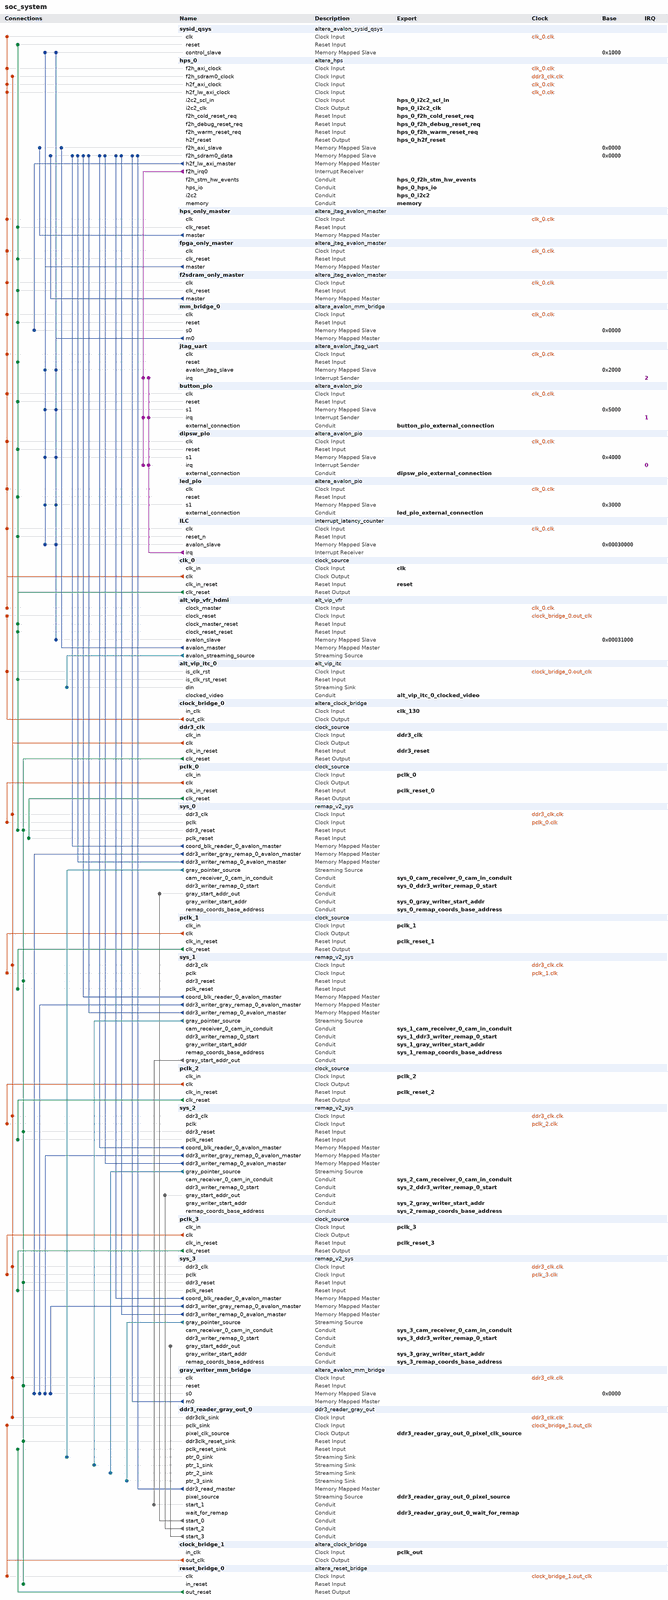
[diagram p0: system contents, whole]
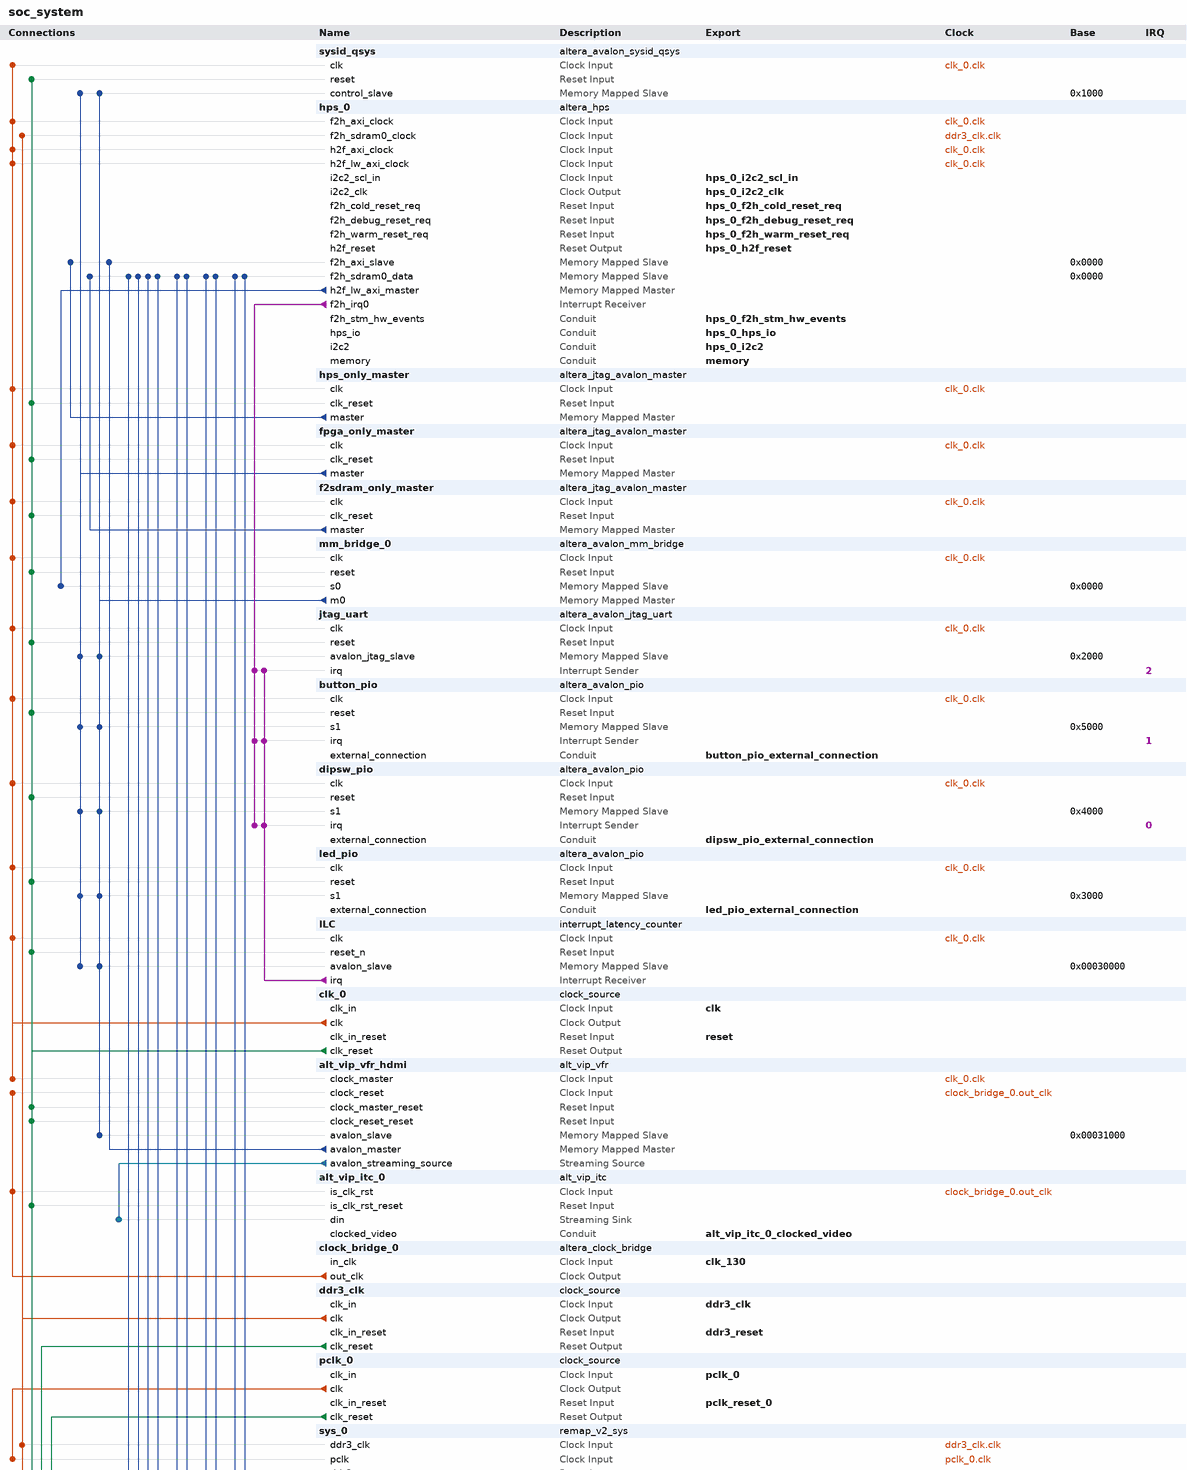
[diagram p1: system contents, upper part]
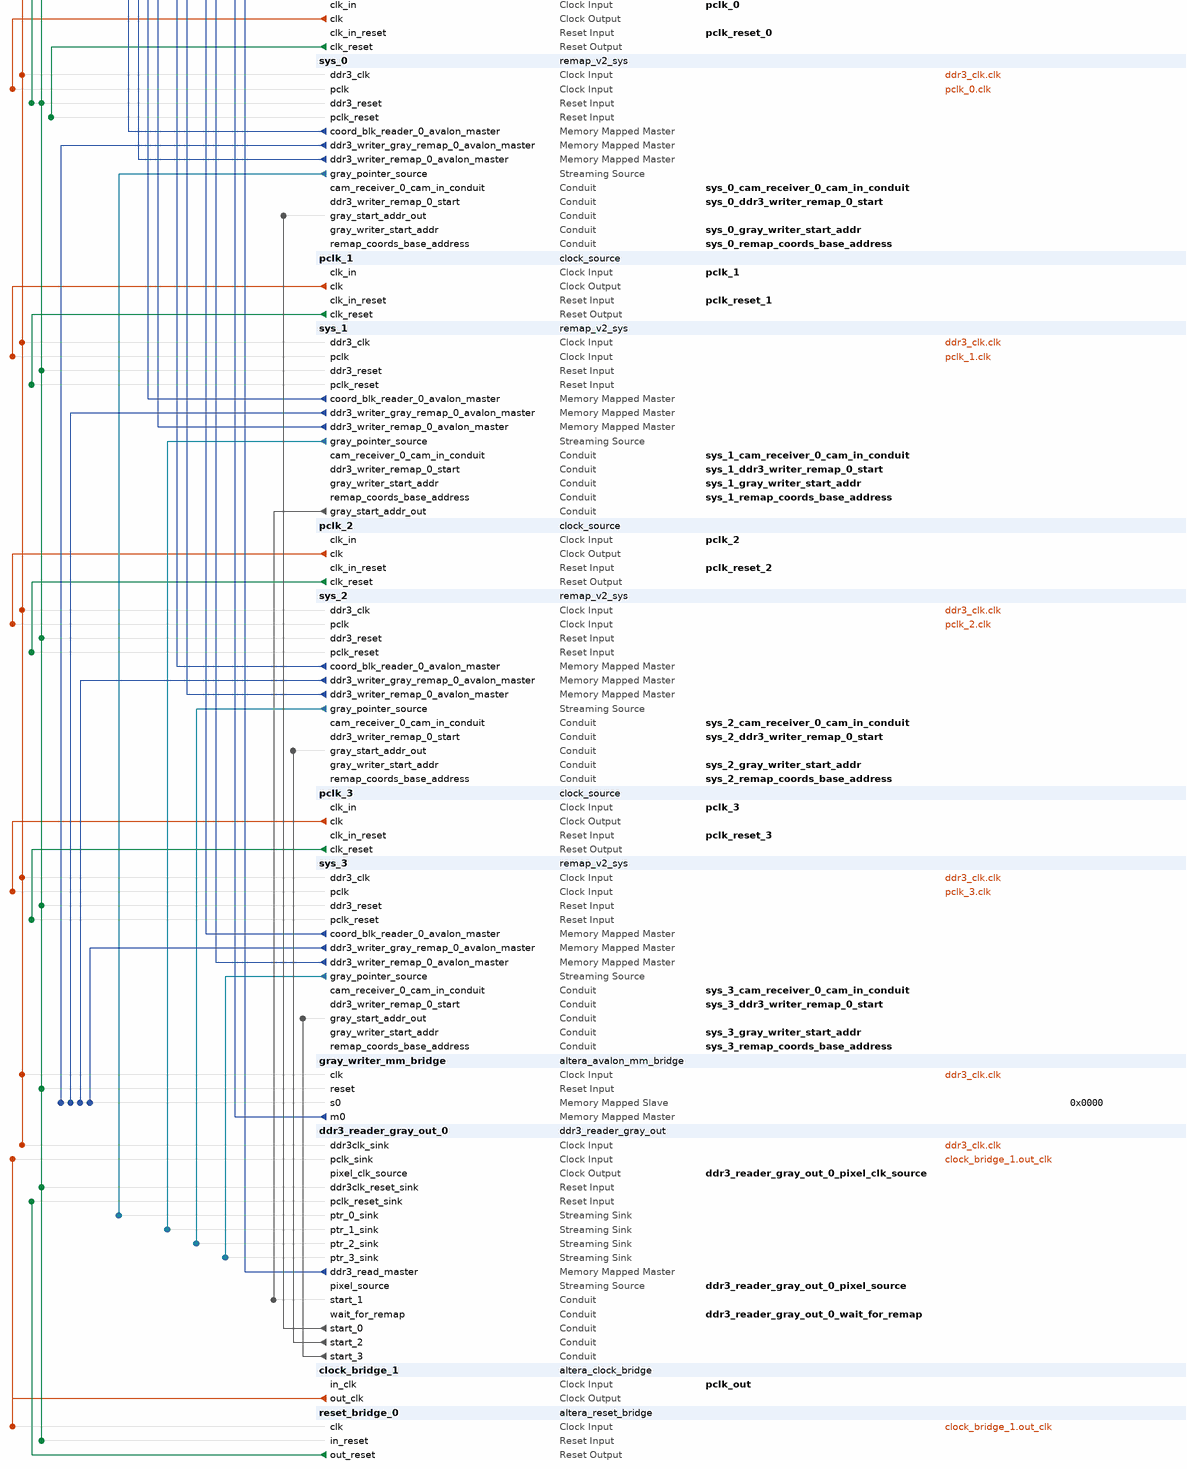
[diagram p2: system contents, lower part]
# Platform Designer (Qsys) system soc_system, Cyclone V 5CSEBA6U23I7
# Parameters at their usual value, and those the tool derives, are not listed.
package require -exact qsys 18.1
create_system soc_system
set_project_property DEVICE_FAMILY {Cyclone V}
set_project_property DEVICE 5CSEBA6U23I7

add_instance sysid_qsys altera_avalon_sysid_qsys 18.1
set_instance_parameter_value sysid_qsys id -1395322110

add_instance hps_0 altera_hps 18.1
set_instance_parameter_value hps_0 EMAC1_Mode RGMII
set_instance_parameter_value hps_0 EMAC1_PinMuxing {HPS I/O Set 0}
set_instance_parameter_value hps_0 F2SCLK_COLDRST_Enable true
set_instance_parameter_value hps_0 F2SCLK_DBGRST_Enable true
set_instance_parameter_value hps_0 F2SCLK_WARMRST_Enable true
set_instance_parameter_value hps_0 F2SDRAM_Type {Avalon-MM Bidirectional}
set_instance_parameter_value hps_0 F2SDRAM_Width 256
set_instance_parameter_value hps_0 F2SINTERRUPT_Enable true
set_instance_parameter_value hps_0 F2S_Width 3
set_instance_parameter_value hps_0 FPGA_PERIPHERAL_OUTPUT_CLOCK_FREQ_EMAC0_GTX_CLK 100
set_instance_parameter_value hps_0 FPGA_PERIPHERAL_OUTPUT_CLOCK_FREQ_EMAC0_MD_CLK 100.0
set_instance_parameter_value hps_0 FPGA_PERIPHERAL_OUTPUT_CLOCK_FREQ_EMAC1_GTX_CLK 100
set_instance_parameter_value hps_0 FPGA_PERIPHERAL_OUTPUT_CLOCK_FREQ_EMAC1_MD_CLK 100.0
set_instance_parameter_value hps_0 HPS_PROTOCOL DDR3
set_instance_parameter_value hps_0 I2C0_Mode I2C
set_instance_parameter_value hps_0 I2C0_PinMuxing {HPS I/O Set 0}
set_instance_parameter_value hps_0 I2C1_Mode I2C
set_instance_parameter_value hps_0 I2C1_PinMuxing {HPS I/O Set 0}
set_instance_parameter_value hps_0 I2C2_Mode Full
set_instance_parameter_value hps_0 I2C2_PinMuxing FPGA
set_instance_parameter_value hps_0 LWH2F_Enable true
set_instance_parameter_value hps_0 MEM_BANKADDR_WIDTH 3
set_instance_parameter_value hps_0 MEM_CLK_FREQ 400.0
set_instance_parameter_value hps_0 MEM_COL_ADDR_WIDTH 10
set_instance_parameter_value hps_0 MEM_DQ_WIDTH 32
set_instance_parameter_value hps_0 MEM_DRV_STR RZQ/6
set_instance_parameter_value hps_0 MEM_ROW_ADDR_WIDTH 15
set_instance_parameter_value hps_0 MEM_RTT_NOM RZQ/6
set_instance_parameter_value hps_0 MEM_RTT_WR {Dynamic ODT off}
set_instance_parameter_value hps_0 MEM_TCL 7
set_instance_parameter_value hps_0 MEM_TFAW_NS 37.5
set_instance_parameter_value hps_0 MEM_TRAS_NS 35.0
set_instance_parameter_value hps_0 MEM_TRCD_NS 13.75
set_instance_parameter_value hps_0 MEM_TRFC_NS 300.0
set_instance_parameter_value hps_0 MEM_TRP_NS 13.75
set_instance_parameter_value hps_0 MEM_VENDOR Other
set_instance_parameter_value hps_0 MEM_WTCL 7
set_instance_parameter_value hps_0 QSPI_Mode N/A
set_instance_parameter_value hps_0 QSPI_PinMuxing Unused
set_instance_parameter_value hps_0 REF_CLK_FREQ 25.0
set_instance_parameter_value hps_0 S2FCLK_USER2CLK 4
set_instance_parameter_value hps_0 S2F_Width 2
set_instance_parameter_value hps_0 SDIO_Mode {4-bit Data}
set_instance_parameter_value hps_0 SDIO_PinMuxing {HPS I/O Set 0}
set_instance_parameter_value hps_0 SPIM1_Mode {Single Slave Select}
set_instance_parameter_value hps_0 SPIM1_PinMuxing {HPS I/O Set 0}
set_instance_parameter_value hps_0 STM_Enable true
set_instance_parameter_value hps_0 TIMING_BOARD_AC_SKEW 0.02
set_instance_parameter_value hps_0 TIMING_BOARD_AC_TO_CK_SKEW 0.0
set_instance_parameter_value hps_0 TIMING_BOARD_DQ_TO_DQS_SKEW 0.0
set_instance_parameter_value hps_0 TIMING_BOARD_MAX_CK_DELAY 0.6
set_instance_parameter_value hps_0 TIMING_BOARD_MAX_DQS_DELAY 0.6
set_instance_parameter_value hps_0 TIMING_BOARD_SKEW_BETWEEN_DQS 0.02
set_instance_parameter_value hps_0 TIMING_BOARD_SKEW_CKDQS_DIMM_MAX 0.01
set_instance_parameter_value hps_0 TIMING_BOARD_SKEW_CKDQS_DIMM_MIN -0.01
set_instance_parameter_value hps_0 TIMING_BOARD_SKEW_WITHIN_DQS 0.02
set_instance_parameter_value hps_0 TIMING_TDH 125
set_instance_parameter_value hps_0 TIMING_TDQSCK 400
set_instance_parameter_value hps_0 TIMING_TDQSQ 120
set_instance_parameter_value hps_0 TIMING_TDS 50
set_instance_parameter_value hps_0 TIMING_TIH 250
set_instance_parameter_value hps_0 TIMING_TIS 175
set_instance_parameter_value hps_0 TIMING_TQSH 0.38
set_instance_parameter_value hps_0 UART0_Mode {No Flow Control}
set_instance_parameter_value hps_0 UART0_PinMuxing {HPS I/O Set 0}
set_instance_parameter_value hps_0 USB1_Mode SDR
set_instance_parameter_value hps_0 USB1_PinMuxing {HPS I/O Set 0}
set_instance_parameter_value hps_0 desired_cfg_clk_mhz 100.0
set_instance_parameter_value hps_0 desired_qspi_clk_mhz 370.0

add_instance hps_only_master altera_jtag_avalon_master 18.1

add_instance fpga_only_master altera_jtag_avalon_master 18.1

add_instance f2sdram_only_master altera_jtag_avalon_master 18.1

add_instance mm_bridge_0 altera_avalon_mm_bridge 18.1
set_instance_parameter_value mm_bridge_0 ADDRESS_UNITS SYMBOLS
set_instance_parameter_value mm_bridge_0 ADDRESS_WIDTH 10
set_instance_parameter_value mm_bridge_0 DATA_WIDTH 32
set_instance_parameter_value mm_bridge_0 MAX_PENDING_RESPONSES 4
set_instance_parameter_value mm_bridge_0 USE_AUTO_ADDRESS_WIDTH 1

add_instance jtag_uart altera_avalon_jtag_uart 18.1
set_instance_parameter_value jtag_uart allowMultipleConnections true
set_instance_parameter_value jtag_uart simInteractiveOptions INTERACTIVE_ASCII_OUTPUT

add_instance button_pio altera_avalon_pio 18.1
set_instance_parameter_value button_pio bitClearingEdgeCapReg true
set_instance_parameter_value button_pio captureEdge true
set_instance_parameter_value button_pio direction Input
set_instance_parameter_value button_pio edgeType FALLING
set_instance_parameter_value button_pio generateIRQ true
set_instance_parameter_value button_pio irqType EDGE
set_instance_parameter_value button_pio width 2

add_instance dipsw_pio altera_avalon_pio 18.1
set_instance_parameter_value dipsw_pio bitClearingEdgeCapReg true
set_instance_parameter_value dipsw_pio captureEdge true
set_instance_parameter_value dipsw_pio direction Input
set_instance_parameter_value dipsw_pio edgeType ANY
set_instance_parameter_value dipsw_pio generateIRQ true
set_instance_parameter_value dipsw_pio irqType EDGE
set_instance_parameter_value dipsw_pio width 4

add_instance led_pio altera_avalon_pio 18.1
set_instance_parameter_value led_pio direction Output
set_instance_parameter_value led_pio resetValue 255
set_instance_parameter_value led_pio width 8

add_instance ILC interrupt_latency_counter 18.1

add_instance clk_0 clock_source 18.1
set_instance_parameter_value clk_0 clockFrequency 50000000

add_instance alt_vip_vfr_hdmi alt_vip_vfr 14.0
set_instance_parameter_value alt_vip_vfr_hdmi MAX_IMAGE_WIDTH 1024

add_instance alt_vip_itc_0 alt_vip_itc 14.0
set_instance_parameter_value alt_vip_itc_0 FIFO_DEPTH 1920
set_instance_parameter_value alt_vip_itc_0 H_ACTIVE_PIXELS 1024
set_instance_parameter_value alt_vip_itc_0 H_BACK_PORCH 160
set_instance_parameter_value alt_vip_itc_0 H_FRONT_PORCH 24
set_instance_parameter_value alt_vip_itc_0 H_SYNC_LENGTH 136
set_instance_parameter_value alt_vip_itc_0 NUMBER_OF_COLOUR_PLANES 4
set_instance_parameter_value alt_vip_itc_0 THRESHOLD 1919
set_instance_parameter_value alt_vip_itc_0 V_ACTIVE_LINES 768
set_instance_parameter_value alt_vip_itc_0 V_BACK_PORCH 29
set_instance_parameter_value alt_vip_itc_0 V_FRONT_PORCH 3
set_instance_parameter_value alt_vip_itc_0 V_SYNC_LENGTH 6

add_instance clock_bridge_0 altera_clock_bridge 18.1
set_instance_parameter_value clock_bridge_0 DERIVED_CLOCK_RATE 0
set_instance_parameter_value clock_bridge_0 EXPLICIT_CLOCK_RATE 0

add_instance ddr3_clk clock_source 18.1
set_instance_parameter_value ddr3_clk clockFrequency 100000000

add_instance pclk_0 clock_source 18.1
set_instance_parameter_value pclk_0 clockFrequency 96000000

add_instance sys_0 remap_v2_sys 1.0

add_instance pclk_1 clock_source 18.1
set_instance_parameter_value pclk_1 clockFrequency 96000000

add_instance sys_1 remap_v2_sys 1.0

add_instance pclk_2 clock_source 18.1
set_instance_parameter_value pclk_2 clockFrequency 96000000

add_instance sys_2 remap_v2_sys 1.0

add_instance pclk_3 clock_source 18.1
set_instance_parameter_value pclk_3 clockFrequency 96000000

add_instance sys_3 remap_v2_sys 1.0

add_instance gray_writer_mm_bridge altera_avalon_mm_bridge 18.1
set_instance_parameter_value gray_writer_mm_bridge ADDRESS_UNITS WORDS
set_instance_parameter_value gray_writer_mm_bridge ADDRESS_WIDTH 27
set_instance_parameter_value gray_writer_mm_bridge DATA_WIDTH 256
set_instance_parameter_value gray_writer_mm_bridge MAX_PENDING_RESPONSES 4
set_instance_parameter_value gray_writer_mm_bridge USE_AUTO_ADDRESS_WIDTH 0

add_instance ddr3_reader_gray_out_0 ddr3_reader_gray_out 1.0
set_instance_parameter_value ddr3_reader_gray_out_0 frame_lines 480
set_instance_parameter_value ddr3_reader_gray_out_0 frame_real_width 720
set_instance_parameter_value ddr3_reader_gray_out_0 frame_width 768
set_instance_parameter_value ddr3_reader_gray_out_0 in_width 8
set_instance_parameter_value ddr3_reader_gray_out_0 no_input 1
set_instance_parameter_value ddr3_reader_gray_out_0 test_pattern 0

add_instance clock_bridge_1 altera_clock_bridge 18.1
set_instance_parameter_value clock_bridge_1 DERIVED_CLOCK_RATE 0
set_instance_parameter_value clock_bridge_1 EXPLICIT_CLOCK_RATE 25000000

add_instance reset_bridge_0 altera_reset_bridge 18.1
set_instance_parameter_value reset_bridge_0 ACTIVE_LOW_RESET 0
set_instance_parameter_value reset_bridge_0 SYNCHRONOUS_EDGES deassert

# connections
add_connection clk_0.clk alt_vip_vfr_hdmi.clock_master clock
add_connection clk_0.clk button_pio.clk clock
add_connection clk_0.clk dipsw_pio.clk clock
add_connection clk_0.clk f2sdram_only_master.clk clock
add_connection clk_0.clk fpga_only_master.clk clock
add_connection clk_0.clk hps_0.f2h_axi_clock clock
add_connection clk_0.clk hps_0.h2f_axi_clock clock
add_connection clk_0.clk hps_0.h2f_lw_axi_clock clock
add_connection clk_0.clk hps_only_master.clk clock
add_connection clk_0.clk ILC.clk clock
add_connection clk_0.clk jtag_uart.clk clock
add_connection clk_0.clk led_pio.clk clock
add_connection clk_0.clk mm_bridge_0.clk clock
add_connection clk_0.clk sysid_qsys.clk clock
add_connection clock_bridge_0.out_clk alt_vip_itc_0.is_clk_rst clock
add_connection clock_bridge_0.out_clk alt_vip_vfr_hdmi.clock_reset clock
add_connection clock_bridge_1.out_clk ddr3_reader_gray_out_0.pclk_sink clock
add_connection clock_bridge_1.out_clk reset_bridge_0.clk clock
add_connection ddr3_clk.clk ddr3_reader_gray_out_0.ddr3clk_sink clock
add_connection ddr3_clk.clk gray_writer_mm_bridge.clk clock
add_connection ddr3_clk.clk hps_0.f2h_sdram0_clock clock
add_connection ddr3_clk.clk sys_0.ddr3_clk clock
add_connection ddr3_clk.clk sys_1.ddr3_clk clock
add_connection ddr3_clk.clk sys_2.ddr3_clk clock
add_connection ddr3_clk.clk sys_3.ddr3_clk clock
add_connection pclk_0.clk sys_0.pclk clock
add_connection pclk_1.clk sys_1.pclk clock
add_connection pclk_2.clk sys_2.pclk clock
add_connection pclk_3.clk sys_3.pclk clock
add_connection clk_0.clk_reset alt_vip_itc_0.is_clk_rst_reset reset
add_connection clk_0.clk_reset alt_vip_vfr_hdmi.clock_master_reset reset
add_connection clk_0.clk_reset alt_vip_vfr_hdmi.clock_reset_reset reset
add_connection clk_0.clk_reset button_pio.reset reset
add_connection clk_0.clk_reset dipsw_pio.reset reset
add_connection clk_0.clk_reset f2sdram_only_master.clk_reset reset
add_connection clk_0.clk_reset fpga_only_master.clk_reset reset
add_connection clk_0.clk_reset hps_only_master.clk_reset reset
add_connection clk_0.clk_reset ILC.reset_n reset
add_connection clk_0.clk_reset jtag_uart.reset reset
add_connection clk_0.clk_reset led_pio.reset reset
add_connection clk_0.clk_reset mm_bridge_0.reset reset
add_connection clk_0.clk_reset sys_0.ddr3_reset reset
add_connection clk_0.clk_reset sysid_qsys.reset reset
add_connection ddr3_clk.clk_reset ddr3_reader_gray_out_0.ddr3clk_reset_sink reset
add_connection ddr3_clk.clk_reset gray_writer_mm_bridge.reset reset
add_connection ddr3_clk.clk_reset reset_bridge_0.in_reset reset
add_connection ddr3_clk.clk_reset sys_0.ddr3_reset reset
add_connection ddr3_clk.clk_reset sys_1.ddr3_reset reset
add_connection ddr3_clk.clk_reset sys_2.ddr3_reset reset
add_connection ddr3_clk.clk_reset sys_3.ddr3_reset reset
add_connection pclk_0.clk_reset sys_0.pclk_reset reset
add_connection pclk_1.clk_reset sys_1.pclk_reset reset
add_connection pclk_2.clk_reset sys_2.pclk_reset reset
add_connection pclk_3.clk_reset sys_3.pclk_reset reset
add_connection reset_bridge_0.out_reset ddr3_reader_gray_out_0.pclk_reset_sink reset
add_connection alt_vip_vfr_hdmi.avalon_master hps_0.f2h_axi_slave avalon
set_connection_parameter_value alt_vip_vfr_hdmi.avalon_master/hps_0.f2h_axi_slave baseAddress 0x0000
add_connection ddr3_reader_gray_out_0.ddr3_read_master hps_0.f2h_sdram0_data avalon
set_connection_parameter_value ddr3_reader_gray_out_0.ddr3_read_master/hps_0.f2h_sdram0_data baseAddress 0x0000
add_connection f2sdram_only_master.master hps_0.f2h_sdram0_data avalon
set_connection_parameter_value f2sdram_only_master.master/hps_0.f2h_sdram0_data baseAddress 0x0000
add_connection fpga_only_master.master button_pio.s1 avalon
set_connection_parameter_value fpga_only_master.master/button_pio.s1 baseAddress 0x5000
add_connection fpga_only_master.master dipsw_pio.s1 avalon
set_connection_parameter_value fpga_only_master.master/dipsw_pio.s1 baseAddress 0x4000
add_connection fpga_only_master.master ILC.avalon_slave avalon
set_connection_parameter_value fpga_only_master.master/ILC.avalon_slave baseAddress 0x00030000
add_connection fpga_only_master.master jtag_uart.avalon_jtag_slave avalon
set_connection_parameter_value fpga_only_master.master/jtag_uart.avalon_jtag_slave baseAddress 0x2000
add_connection fpga_only_master.master led_pio.s1 avalon
set_connection_parameter_value fpga_only_master.master/led_pio.s1 baseAddress 0x3000
add_connection fpga_only_master.master sysid_qsys.control_slave avalon
set_connection_parameter_value fpga_only_master.master/sysid_qsys.control_slave baseAddress 0x1000
add_connection gray_writer_mm_bridge.m0 hps_0.f2h_sdram0_data avalon
set_connection_parameter_value gray_writer_mm_bridge.m0/hps_0.f2h_sdram0_data baseAddress 0x0000
add_connection hps_0.h2f_lw_axi_master mm_bridge_0.s0 avalon
set_connection_parameter_value hps_0.h2f_lw_axi_master/mm_bridge_0.s0 baseAddress 0x0000
add_connection hps_only_master.master hps_0.f2h_axi_slave avalon
set_connection_parameter_value hps_only_master.master/hps_0.f2h_axi_slave baseAddress 0x0000
add_connection mm_bridge_0.m0 alt_vip_vfr_hdmi.avalon_slave avalon
set_connection_parameter_value mm_bridge_0.m0/alt_vip_vfr_hdmi.avalon_slave baseAddress 0x00031000
add_connection mm_bridge_0.m0 button_pio.s1 avalon
set_connection_parameter_value mm_bridge_0.m0/button_pio.s1 baseAddress 0x5000
add_connection mm_bridge_0.m0 dipsw_pio.s1 avalon
set_connection_parameter_value mm_bridge_0.m0/dipsw_pio.s1 baseAddress 0x4000
add_connection mm_bridge_0.m0 ILC.avalon_slave avalon
set_connection_parameter_value mm_bridge_0.m0/ILC.avalon_slave baseAddress 0x00030000
add_connection mm_bridge_0.m0 jtag_uart.avalon_jtag_slave avalon
set_connection_parameter_value mm_bridge_0.m0/jtag_uart.avalon_jtag_slave baseAddress 0x2000
add_connection mm_bridge_0.m0 led_pio.s1 avalon
set_connection_parameter_value mm_bridge_0.m0/led_pio.s1 baseAddress 0x3000
add_connection mm_bridge_0.m0 sysid_qsys.control_slave avalon
set_connection_parameter_value mm_bridge_0.m0/sysid_qsys.control_slave baseAddress 0x1000
add_connection sys_0.coord_blk_reader_0_avalon_master hps_0.f2h_sdram0_data avalon
set_connection_parameter_value sys_0.coord_blk_reader_0_avalon_master/hps_0.f2h_sdram0_data baseAddress 0x0000
add_connection sys_0.ddr3_writer_gray_remap_0_avalon_master gray_writer_mm_bridge.s0 avalon
set_connection_parameter_value sys_0.ddr3_writer_gray_remap_0_avalon_master/gray_writer_mm_bridge.s0 baseAddress 0x0000
add_connection sys_0.ddr3_writer_remap_0_avalon_master hps_0.f2h_sdram0_data avalon
set_connection_parameter_value sys_0.ddr3_writer_remap_0_avalon_master/hps_0.f2h_sdram0_data baseAddress 0x0000
add_connection sys_1.coord_blk_reader_0_avalon_master hps_0.f2h_sdram0_data avalon
set_connection_parameter_value sys_1.coord_blk_reader_0_avalon_master/hps_0.f2h_sdram0_data baseAddress 0x0000
add_connection sys_1.ddr3_writer_gray_remap_0_avalon_master gray_writer_mm_bridge.s0 avalon
set_connection_parameter_value sys_1.ddr3_writer_gray_remap_0_avalon_master/gray_writer_mm_bridge.s0 baseAddress 0x0000
add_connection sys_1.ddr3_writer_remap_0_avalon_master hps_0.f2h_sdram0_data avalon
set_connection_parameter_value sys_1.ddr3_writer_remap_0_avalon_master/hps_0.f2h_sdram0_data baseAddress 0x0000
add_connection sys_2.coord_blk_reader_0_avalon_master hps_0.f2h_sdram0_data avalon
set_connection_parameter_value sys_2.coord_blk_reader_0_avalon_master/hps_0.f2h_sdram0_data baseAddress 0x0000
add_connection sys_2.ddr3_writer_gray_remap_0_avalon_master gray_writer_mm_bridge.s0 avalon
set_connection_parameter_value sys_2.ddr3_writer_gray_remap_0_avalon_master/gray_writer_mm_bridge.s0 baseAddress 0x0000
add_connection sys_2.ddr3_writer_remap_0_avalon_master hps_0.f2h_sdram0_data avalon
set_connection_parameter_value sys_2.ddr3_writer_remap_0_avalon_master/hps_0.f2h_sdram0_data baseAddress 0x0000
add_connection sys_3.coord_blk_reader_0_avalon_master hps_0.f2h_sdram0_data avalon
set_connection_parameter_value sys_3.coord_blk_reader_0_avalon_master/hps_0.f2h_sdram0_data baseAddress 0x0000
add_connection sys_3.ddr3_writer_gray_remap_0_avalon_master gray_writer_mm_bridge.s0 avalon
set_connection_parameter_value sys_3.ddr3_writer_gray_remap_0_avalon_master/gray_writer_mm_bridge.s0 baseAddress 0x0000
add_connection sys_3.ddr3_writer_remap_0_avalon_master hps_0.f2h_sdram0_data avalon
set_connection_parameter_value sys_3.ddr3_writer_remap_0_avalon_master/hps_0.f2h_sdram0_data baseAddress 0x0000
add_connection alt_vip_vfr_hdmi.avalon_streaming_source alt_vip_itc_0.din avalon_streaming
add_connection sys_0.gray_pointer_source ddr3_reader_gray_out_0.ptr_0_sink avalon_streaming
add_connection sys_1.gray_pointer_source ddr3_reader_gray_out_0.ptr_1_sink avalon_streaming
add_connection sys_2.gray_pointer_source ddr3_reader_gray_out_0.ptr_2_sink avalon_streaming
add_connection sys_3.gray_pointer_source ddr3_reader_gray_out_0.ptr_3_sink avalon_streaming
add_connection ddr3_reader_gray_out_0.start_0 sys_0.gray_start_addr_out conduit
add_connection ddr3_reader_gray_out_0.start_2 sys_2.gray_start_addr_out conduit
add_connection ddr3_reader_gray_out_0.start_3 sys_3.gray_start_addr_out conduit
add_connection sys_1.gray_start_addr_out ddr3_reader_gray_out_0.start_1 conduit
add_connection hps_0.f2h_irq0 button_pio.irq interrupt
set_connection_parameter_value hps_0.f2h_irq0/button_pio.irq irqNumber 1
add_connection hps_0.f2h_irq0 dipsw_pio.irq interrupt
set_connection_parameter_value hps_0.f2h_irq0/dipsw_pio.irq irqNumber 0
add_connection hps_0.f2h_irq0 jtag_uart.irq interrupt
set_connection_parameter_value hps_0.f2h_irq0/jtag_uart.irq irqNumber 2
add_connection ILC.irq button_pio.irq interrupt
set_connection_parameter_value ILC.irq/button_pio.irq irqNumber 1
add_connection ILC.irq dipsw_pio.irq interrupt
set_connection_parameter_value ILC.irq/dipsw_pio.irq irqNumber 0
add_connection ILC.irq jtag_uart.irq interrupt
set_connection_parameter_value ILC.irq/jtag_uart.irq irqNumber 2

# exported interfaces
add_interface alt_vip_itc_0_clocked_video conduit end
set_interface_property alt_vip_itc_0_clocked_video EXPORT_OF alt_vip_itc_0.clocked_video
add_interface button_pio_external_connection conduit end
set_interface_property button_pio_external_connection EXPORT_OF button_pio.external_connection
add_interface clk clock sink
set_interface_property clk EXPORT_OF clk_0.clk_in
add_interface clk_130 clock sink
set_interface_property clk_130 EXPORT_OF clock_bridge_0.in_clk
add_interface ddr3_clk clock sink
set_interface_property ddr3_clk EXPORT_OF ddr3_clk.clk_in
add_interface ddr3_reader_gray_out_0_pixel_clk_source clock source
set_interface_property ddr3_reader_gray_out_0_pixel_clk_source EXPORT_OF ddr3_reader_gray_out_0.pixel_clk_source
add_interface ddr3_reader_gray_out_0_pixel_source avalon_streaming source
set_interface_property ddr3_reader_gray_out_0_pixel_source EXPORT_OF ddr3_reader_gray_out_0.pixel_source
add_interface ddr3_reader_gray_out_0_wait_for_remap conduit end
set_interface_property ddr3_reader_gray_out_0_wait_for_remap EXPORT_OF ddr3_reader_gray_out_0.wait_for_remap
add_interface ddr3_reset reset sink
set_interface_property ddr3_reset EXPORT_OF ddr3_clk.clk_in_reset
add_interface dipsw_pio_external_connection conduit end
set_interface_property dipsw_pio_external_connection EXPORT_OF dipsw_pio.external_connection
add_interface hps_0_f2h_cold_reset_req reset sink
set_interface_property hps_0_f2h_cold_reset_req EXPORT_OF hps_0.f2h_cold_reset_req
add_interface hps_0_f2h_debug_reset_req reset sink
set_interface_property hps_0_f2h_debug_reset_req EXPORT_OF hps_0.f2h_debug_reset_req
add_interface hps_0_f2h_stm_hw_events conduit end
set_interface_property hps_0_f2h_stm_hw_events EXPORT_OF hps_0.f2h_stm_hw_events
add_interface hps_0_f2h_warm_reset_req reset sink
set_interface_property hps_0_f2h_warm_reset_req EXPORT_OF hps_0.f2h_warm_reset_req
add_interface hps_0_h2f_reset reset source
set_interface_property hps_0_h2f_reset EXPORT_OF hps_0.h2f_reset
add_interface hps_0_hps_io conduit end
set_interface_property hps_0_hps_io EXPORT_OF hps_0.hps_io
add_interface hps_0_i2c2 conduit end
set_interface_property hps_0_i2c2 EXPORT_OF hps_0.i2c2
add_interface hps_0_i2c2_clk clock source
set_interface_property hps_0_i2c2_clk EXPORT_OF hps_0.i2c2_clk
add_interface hps_0_i2c2_scl_in clock sink
set_interface_property hps_0_i2c2_scl_in EXPORT_OF hps_0.i2c2_scl_in
add_interface led_pio_external_connection conduit end
set_interface_property led_pio_external_connection EXPORT_OF led_pio.external_connection
add_interface memory conduit end
set_interface_property memory EXPORT_OF hps_0.memory
add_interface pclk_0 clock sink
set_interface_property pclk_0 EXPORT_OF pclk_0.clk_in
add_interface pclk_1 clock sink
set_interface_property pclk_1 EXPORT_OF pclk_1.clk_in
add_interface pclk_2 clock sink
set_interface_property pclk_2 EXPORT_OF pclk_2.clk_in
add_interface pclk_3 clock sink
set_interface_property pclk_3 EXPORT_OF pclk_3.clk_in
add_interface pclk_out clock sink
set_interface_property pclk_out EXPORT_OF clock_bridge_1.in_clk
add_interface pclk_reset_0 reset sink
set_interface_property pclk_reset_0 EXPORT_OF pclk_0.clk_in_reset
add_interface pclk_reset_1 reset sink
set_interface_property pclk_reset_1 EXPORT_OF pclk_1.clk_in_reset
add_interface pclk_reset_2 reset sink
set_interface_property pclk_reset_2 EXPORT_OF pclk_2.clk_in_reset
add_interface pclk_reset_3 reset sink
set_interface_property pclk_reset_3 EXPORT_OF pclk_3.clk_in_reset
add_interface reset reset sink
set_interface_property reset EXPORT_OF clk_0.clk_in_reset
add_interface sys_0_cam_receiver_0_cam_in_conduit conduit end
set_interface_property sys_0_cam_receiver_0_cam_in_conduit EXPORT_OF sys_0.cam_receiver_0_cam_in_conduit
add_interface sys_0_ddr3_writer_remap_0_start conduit end
set_interface_property sys_0_ddr3_writer_remap_0_start EXPORT_OF sys_0.ddr3_writer_remap_0_start
add_interface sys_0_gray_writer_start_addr conduit end
set_interface_property sys_0_gray_writer_start_addr EXPORT_OF sys_0.gray_writer_start_addr
add_interface sys_0_remap_coords_base_address conduit end
set_interface_property sys_0_remap_coords_base_address EXPORT_OF sys_0.remap_coords_base_address
add_interface sys_1_cam_receiver_0_cam_in_conduit conduit end
set_interface_property sys_1_cam_receiver_0_cam_in_conduit EXPORT_OF sys_1.cam_receiver_0_cam_in_conduit
add_interface sys_1_ddr3_writer_remap_0_start conduit end
set_interface_property sys_1_ddr3_writer_remap_0_start EXPORT_OF sys_1.ddr3_writer_remap_0_start
add_interface sys_1_gray_writer_start_addr conduit end
set_interface_property sys_1_gray_writer_start_addr EXPORT_OF sys_1.gray_writer_start_addr
add_interface sys_1_remap_coords_base_address conduit end
set_interface_property sys_1_remap_coords_base_address EXPORT_OF sys_1.remap_coords_base_address
add_interface sys_2_cam_receiver_0_cam_in_conduit conduit end
set_interface_property sys_2_cam_receiver_0_cam_in_conduit EXPORT_OF sys_2.cam_receiver_0_cam_in_conduit
add_interface sys_2_ddr3_writer_remap_0_start conduit end
set_interface_property sys_2_ddr3_writer_remap_0_start EXPORT_OF sys_2.ddr3_writer_remap_0_start
add_interface sys_2_gray_writer_start_addr conduit end
set_interface_property sys_2_gray_writer_start_addr EXPORT_OF sys_2.gray_writer_start_addr
add_interface sys_2_remap_coords_base_address conduit end
set_interface_property sys_2_remap_coords_base_address EXPORT_OF sys_2.remap_coords_base_address
add_interface sys_3_cam_receiver_0_cam_in_conduit conduit end
set_interface_property sys_3_cam_receiver_0_cam_in_conduit EXPORT_OF sys_3.cam_receiver_0_cam_in_conduit
add_interface sys_3_ddr3_writer_remap_0_start conduit end
set_interface_property sys_3_ddr3_writer_remap_0_start EXPORT_OF sys_3.ddr3_writer_remap_0_start
add_interface sys_3_gray_writer_start_addr conduit end
set_interface_property sys_3_gray_writer_start_addr EXPORT_OF sys_3.gray_writer_start_addr
add_interface sys_3_remap_coords_base_address conduit end
set_interface_property sys_3_remap_coords_base_address EXPORT_OF sys_3.remap_coords_base_address

set_interconnect_requirement {$system} qsys_mm.clockCrossingAdapter HANDSHAKE
set_interconnect_requirement {$system} qsys_mm.maxAdditionalLatency 1

save_system soc_system.qsys
